# EAGLE design scheda_hat (EAGLE 6.5.0)
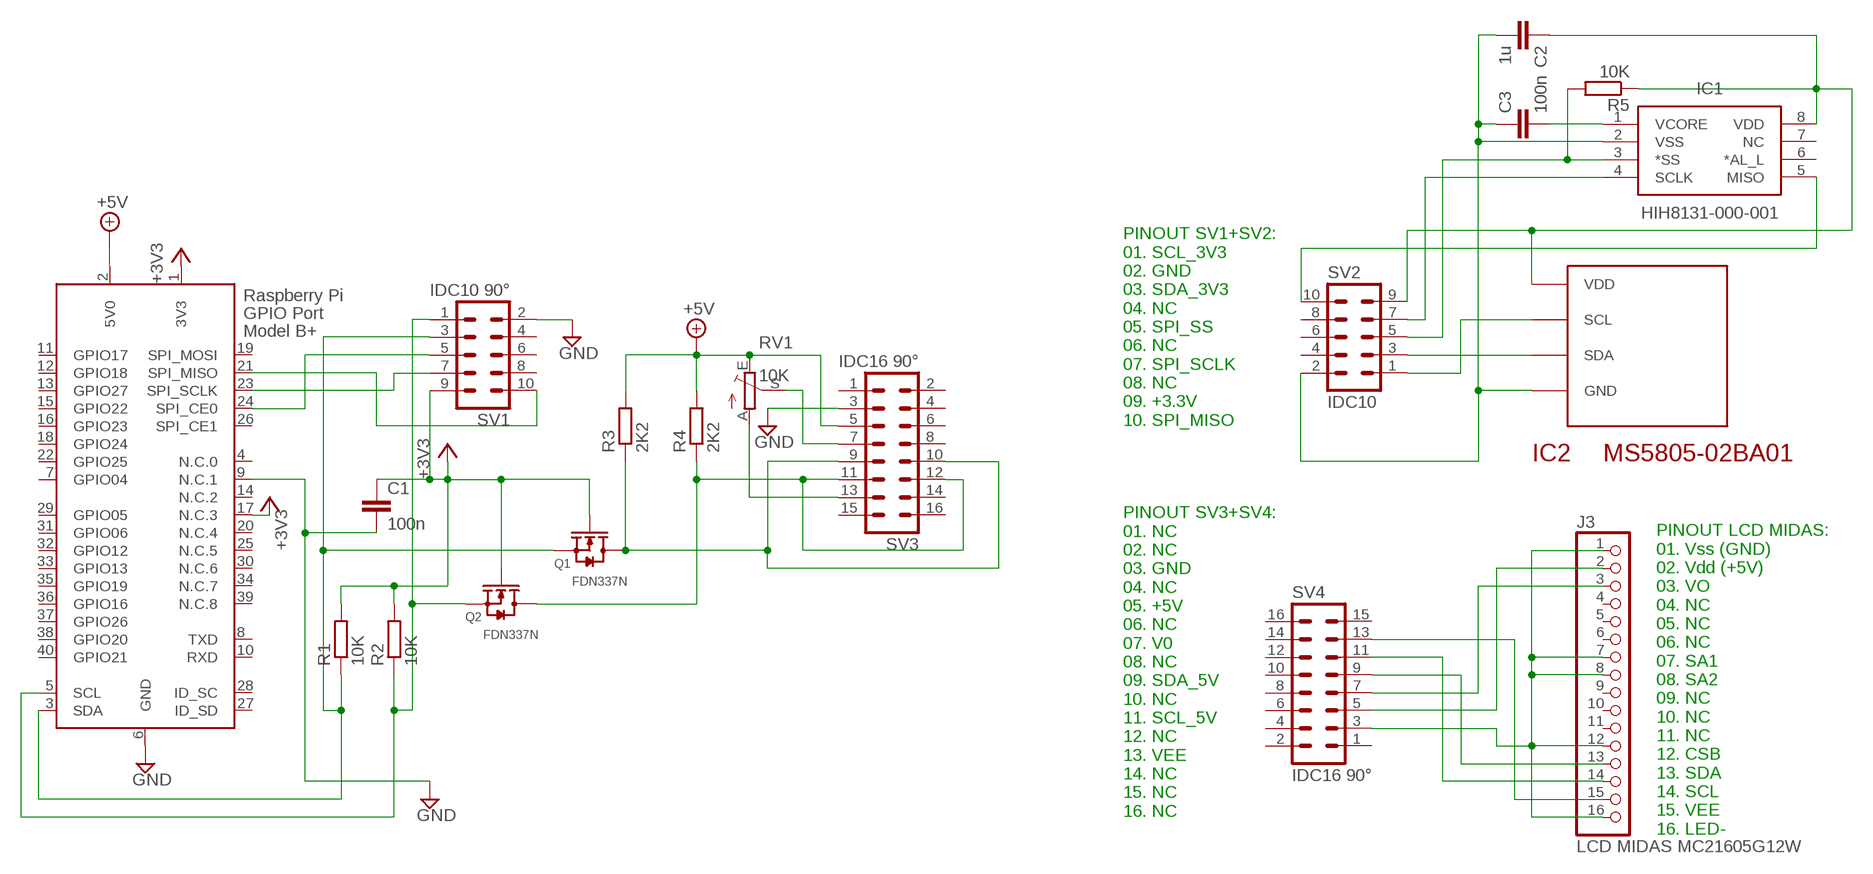
[diagram p0: schematic, sheet 1]

## Parts
C1  100n  C-EUC0805K  [C0805K]
C2  1u  C-EUC0805K  [C0805K]
C3  100n  C-EUC0805K  [C0805K]
IC1  HIH8131-000-001  [SOIC127P600X220-8N]
IC2  MS5805-02BA01  [MS5805-02BA]
J3  LCD MIDAS MC21605G12W  PINHD-1X16  [1X16]
Q1  FDN337N  [SOT95P230X110-3N]
Q2  FDN337N  [SOT95P230X110-3N]
R1  10K  R-EU_R3216  [R3216]
R2  10K  R-EU_R3216  [R3216]
R3  2K2  R-EU_R3216  [R3216]
R4  2K2  R-EU_R3216  [R3216]
R5  10K  R-EU_R3216  [R3216]
RV1  10K  TRIM_EU-CA9V  [CA9V]
SV1  IDC10 90°  ML10L  [ML10L]
SV2  IDC10  ML10  [ML10]
SV3  IDC16 90°  ML16L  [ML16L]
SV4  IDC16 90°  ML16L  [ML16L]
X1  RASPI_BOARD_B+_H  [RASPI_BOARD_B+HAT]

## Nets
+3V3: C1.1 Q1.1(G1) Q2.1(G1) R1.2 R2.2 SV1.9 X1.1(3V3) X1.17(N.C.3)
+5V: R3.2 R4.2 RV1.E SV3.5 X1.2(5V0)
GND: C1.2 SV1.2 SV3.3 X1.6(GND) X1.9(N.C.1)
N$1: IC1.3(*SS) R5.2 SV2.5
N$3: J3.1 J3.7 J3.8 J3.12 J3.16 SV4.3
N$4: RV1.A SV3.13
N$6: J3.15 SV4.13
N$7: C2.2 C3.1 IC1.2(VSS) IC2.P$4(GND) SV2.2
N$8: IC2.P$2(SCL) SV2.1
N$10: IC2.P$3(SDA) SV2.3
N$11: J3.2 SV4.5
N$12: IC1.5(MISO) SV2.10
N$14: IC1.4(SCLK) SV2.7
N$15: J3.3 SV4.7
N$16: J3.13 SV4.9
N$17: J3.14 SV4.11
N$18: C2.1 IC1.8(VDD) IC2.P$1(VDD) R5.1 SV2.9
SCL_3V3: Q2.2(S1) R2.1 SV1.1 X1.5(SCL)
SCL_5V: Q2.3(D1) R4.1 SV3.11 SV3.12
SDA_3V3: Q1.2(S1) R1.1 SV1.3 X1.3(SDA)
SDA_5V: Q1.3(D1) R3.1 SV3.9 SV3.10
SPI_MISO: SV1.10 X1.21(SPI_MISO)
SPI_SCLK: SV1.7 X1.23(SPI_SCLK)
SPI_SS: SV1.5 X1.24(SPI_CE0)
V0: RV1.S SV3.7
VCORE: C3.2 IC1.1(VCORE)
Unconnected: IC1.6(*AL_L) IC1.7(NC) J3.4 J3.5 J3.6 J3.9 J3.10 J3.11 SV1.4 SV1.6 SV1.8 SV2.4 SV2.6 SV2.8 SV3.1 SV3.2 SV3.4 SV3.6 SV3.8 SV3.14 SV3.15 SV3.16 SV4.1 SV4.2 SV4.4 SV4.6 SV4.8 SV4.10 SV4.12 SV4.14 SV4.15 SV4.16 X1.4(N.C.0) X1.7(GPIO04) X1.8(TXD) X1.10(RXD) X1.11(GPIO17) X1.12(GPIO18) X1.13(GPIO27) X1.14(N.C.2) X1.15(GPIO22) X1.16(GPIO23) X1.18(GPIO24) X1.19(SPI_MOSI) X1.20(N.C.4) X1.22(GPIO25) X1.25(N.C.5) X1.26(SPI_CE1) X1.27(ID_SD) X1.28(ID_SC) X1.29(GPIO05) X1.30(N.C.6) X1.31(GPIO06) X1.32(GPIO12) X1.33(GPIO13) X1.34(N.C.7) X1.35(GPIO19) X1.36(GPIO16) X1.37(GPIO26) X1.38(GPIO20) X1.39(N.C.8) X1.40(GPIO21)

## Notes on the sheet
- PINOUT SV1+SV2:
  01. SCL_3V3
  02. GND
  03. SDA_3V3
  04. NC
  05. SPI_SS
  06. NC
  07. SPI_SCLK
  08. NC
  09. +3.3V
  10. SPI_MISO
- PINOUT SV3+SV4:
  01. NC
  02. NC
  03. GND
  04. NC
  05. +5V
  06. NC
  07. V0
  08. NC
  09. SDA_5V
  10. NC
  11. SCL_5V
  12. NC
  13. VEE
  14. NC
  15. NC
  16. NC
- PINOUT LCD MIDAS:
  01. Vss (GND)
  02. Vdd (+5V)
  03. VO
  04. NC
  05. NC
  06. NC
  07. SA1
  08. SA2
  09. NC
  10. NC
  11. NC
  12. CSB
  13. SDA
  14. SCL
  15. VEE
  16. LED-

## Library data of the parts
C1-C3 = resistor:C-EU: CAPACITOR, European symbol
IC1 = tonazza:HIH8131-000-001: Honeywell HIH8131-000-001 Humidity Sensor 8-Pin SOIC, -40 +125 C <http://uk.rs-online.com/largeimages/M1428-01-rs-logo.gif> Source: Datasheet <http://sensing.honeywell.com/honeywell-sensing-humidicon-hih8000-series-product-sheet-009075-7-en.pdf>; DESCRIPTION: Honeywell HIH8131-000-001 Humidity Sensor 8-Pin SOIC, -40 +125 C; HEIGHT: 2.2mm; MANUFACTURER_NAME: Honeywell; MANUFACTURER_PART_NUMBER: HIH8131-000-001; RS_PART_NUMBER: 8748744; SUPPLIER_NAME: RS
IC2 = tonazza:MS5805-02BA01: Absolute Pressure Sensor
J3 = pinhead:PINHD-1X16: PIN HEADER
Q1 Q2 = tonazza:FDN337N: N-channel MOSFET; MPN: FDN337N; OC_FARNELL: 9845356; PACKAGE: SOT-23; SUPPLIER: Fairchild
R1-R5 = resistor:R-EU_: RESISTOR, European symbol
RV1 = pot:TRIM_EU-: POTENTIOMETER
SV1 SV2 = con-harting-ml:ML10: HARTING; OC_FARNELL: unknown; OC_NEWARK: unknown
SV3 SV4 = con-harting-ml:ML16: HARTING; OC_FARNELL: unknown; OC_NEWARK: unknown
X1 = raspberrypi_bastelstube_v13:RASPI_BOARD_B+: Raspberry Pi GPIO connector with markings for the outer dimensions of the Raspberry Pi board model B+ with different sets of drill holes or mounting pads

## Board
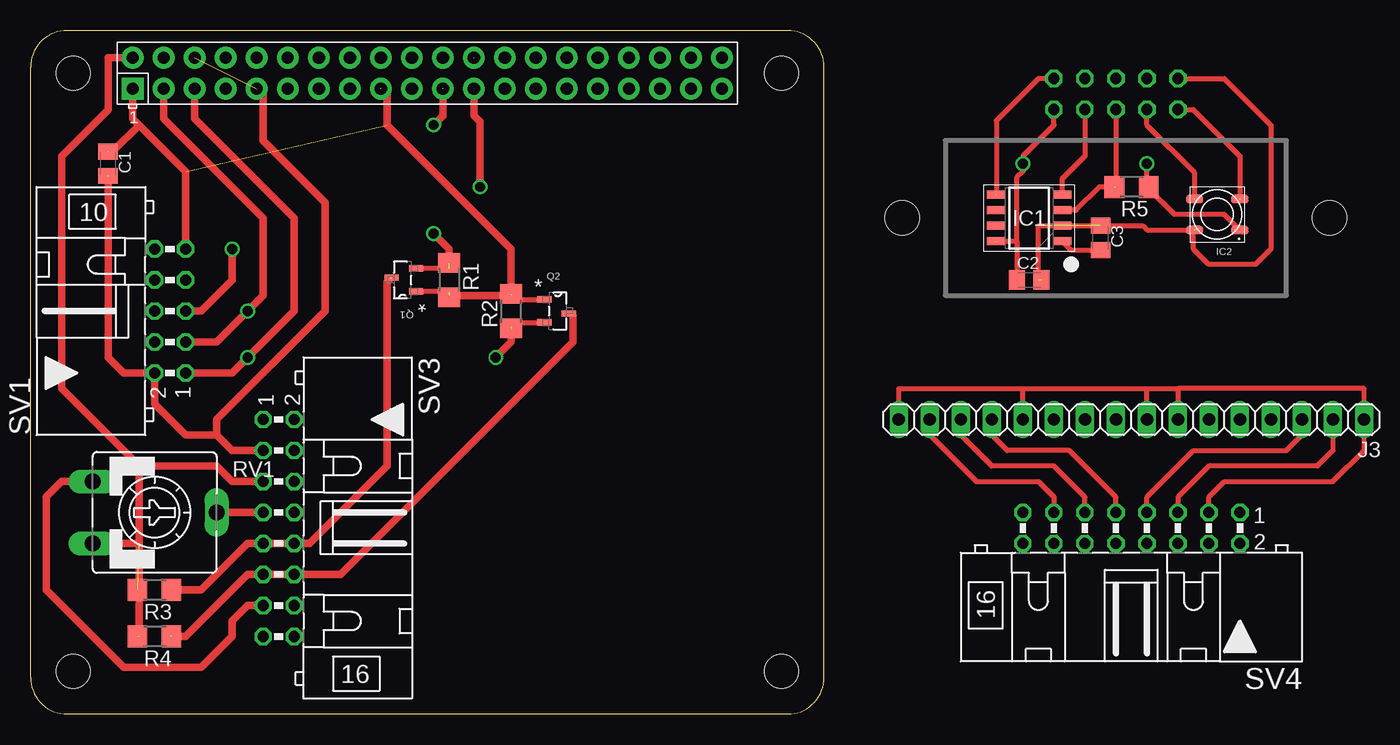
[diagram p1: board, top side]
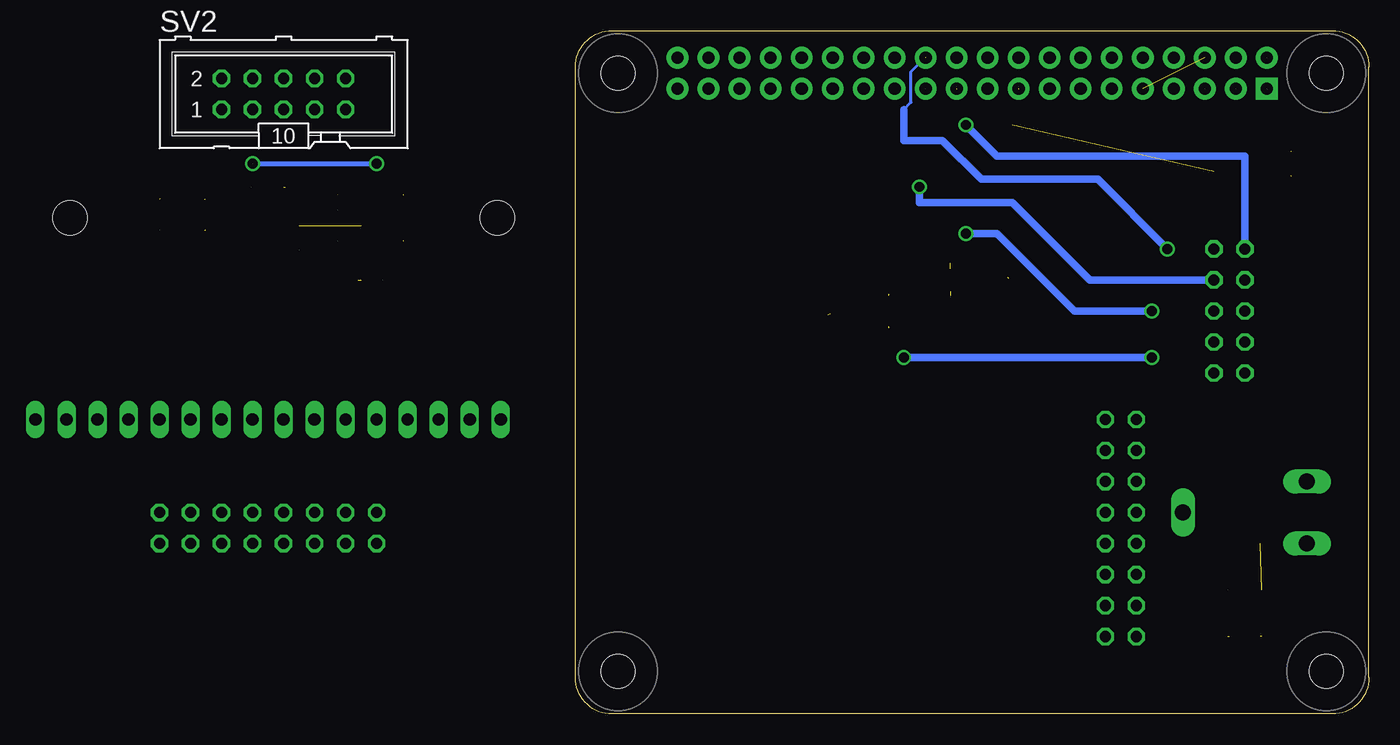
[diagram p2: board, bottom side, seen from below]

Size 65 x 56 mm. Coordinates in mm from the lower left corner, seen from the top.
Copper layers (1*16): Top 0.035mm / dielectric 1.5mm / Bottom 0.035mm
Design rules "tonazza0.5mm *": minimum track width 10mil, minimum drill 24mil, track to track 22mil, track to pad 22mil, pad to pad 22mil, via to via 22mil, smd to smd 8mil, copper to edge 25mil, drill to drill 8mil, minimum pad ring 10mil, minimum via ring 8mil, stop-mask expansion 4mil, vias tented up to drill 0mil, thermal gap 10mil
Holes 2.8 mm at 71.4,40.64 106.4,40.64

### Footprints (pad centres in the part's own frame; a part is rotated, then mirrored left to right if it is on the bottom)
C0805K = smd 1.3 x 1.6: 1 -1,0; 2 1,0
SOIC127P600X220-8N = smd 1.5 x 0.65: 1 -2.7,1.905; 2 -2.7,0.635; 3 -2.7,-0.635; 4 -2.7,-1.905; 5 2.7,-1.905; 6 2.7,-0.635; 7 2.7,0.635; 8 2.7,1.905
MS5805-02BA = smd 1.422 x 0.711: P$1 0.4,3.52; P$2 0.4,0.98; P$3 4.1,0.98; P$4 4.1,3.52
1X16 = drill 1.016 long: 1 -19.05,0; 2 -16.51,0; 3 -13.97,0; 4 -11.43,0; 5 -8.89,0; 6 -6.35,0; 7 -3.81,0; 8 -1.27,0; 9 1.27,0; 10 3.81,0; 11 6.35,0; 12 8.89,0; 13 11.43,0; 14 13.97,0; 15 16.51,0; 16 19.05,0
SOT95P230X110-3N = smd 1.168 x 0.533: 1 -1.092,0.94; 2 -1.092,-0.94 | smd 1.168 x 0.483: 3 0.914,-0.203
R3216 = smd 1.6 x 1.8: 1 -1.4,0; 2 1.4,0
CA9V = drill 1.321 long: A -2.54,-5.08; E 2.54,-5.08; S 0,5.08
ML10L = drill 0.914 octagon: 1 -5.08,-1.27; 2 -5.08,1.27; 3 -2.54,-1.27; 4 -2.54,1.27; 5 0,-1.27; 6 0,1.27; 7 2.54,-1.27; 8 2.54,1.27; 9 5.08,-1.27; 10 5.08,1.27
ML10 = drill 0.914 octagon: 1 -5.08,-1.27; 2 -5.08,1.27; 3 -2.54,-1.27; 4 -2.54,1.27; 5 0,-1.27; 6 0,1.27; 7 2.54,-1.27; 8 2.54,1.27; 9 5.08,-1.27; 10 5.08,1.27
ML16L = drill 0.914 octagon: 1 -8.89,-1.27; 2 -8.89,1.27; 3 -6.35,-1.27; 4 -6.35,1.27; 5 -3.81,-1.27; 6 -3.81,1.27; 7 -1.27,-1.27; 8 -1.27,1.27; 9 1.27,-1.27; 10 1.27,1.27; 11 3.81,-1.27; 12 3.81,1.27; 13 6.35,-1.27; 14 6.35,1.27; 15 8.89,-1.27; 16 8.89,1.27
RASPI_BOARD_B+HAT = drill 1 pad 1.778 square: 1 8.37,51.23 | drill 1 pad 1.778: 2 8.37,53.77; 3 10.91,51.23; 4 10.91,53.77; 5 13.45,51.23; 6 13.45,53.77; 7 15.99,51.23; 8 15.99,53.77; 9 18.53,51.23; 10 18.53,53.77; 11 21.07,51.23; 12 21.07,53.77; 13 23.61,51.23; 14 23.61,53.77; 15 26.15,51.23; 16 26.15,53.77; 17 28.69,51.23; 18 28.69,53.77; 19 31.23,51.23; 20 31.23,53.77; 21 33.77,51.23; 22 33.77,53.77; 23 36.31,51.23; 24 36.31,53.77; 25 38.85,51.23; 26 38.85,53.77; 27 41.39,51.23; 28 41.39,53.77; 29 43.93,51.23; 30 43.93,53.77; 31 46.47,51.23; 32 46.47,53.77; 33 49.01,51.23; 34 49.01,53.77; 35 51.55,51.23; 36 51.55,53.77; 37 54.09,51.23; 38 54.09,53.77; 39 56.63,51.23; 40 56.63,53.77 | hole 2.75: 3.5,3.5; 3.5,52.5; 61.5,3.5; 61.5,52.5

### Placement (x,y rotation side)
C1  6.35,45.09 270 top
C2  81.79,35.56 0 top  (outside the outline)
C3  87.63,39.01 270 top  (outside the outline)
IC1  81.79,40.64 180 top  (outside the outline)
IC2  99.44,43.18 180 top  (outside the outline)
J3  90.17,24.13 180 top  (outside the outline)
Q1  30.48,35.56 180 top
Q2  43.18,33.02 0 top
R1  34.29,35.56 270 top
R2  39.37,33.02 90 top
R3  10.16,10.16 180 top
R4  10.16,6.35 180 top
R5  90.17,43.18 180 top  (outside the outline)
RV1  10.16,16.51 270 top
SV1  11.43,33.02 90 top
SV2  88.9,50.8 0 bottom  (outside the outline)
SV3  20.32,15.24 270 top
SV4  90.17,15.24 180 top  (outside the outline)
X1  0,0 0 top

### Tracks (layer width: path | path; a pad name or v marks a point on that pad's centre or on a via)
+3V3  (7 unrouted)
  Top 0.406: 34.29,34.62 Q1.1 | 39.37,34.29 39.7,33.96 Q2.1
  Top 0.61: SV1.9 12.7,44.45 8.89,48.26 | 8.89,48.26 8.38,48.77 8.38,51.23 | 8.89,48.26 6.73,46.1 C1.1 | R1.2 34.29,34.29 39.37,34.29 39.37,38.1 29.21,48.26 29.21,50.72 28.7,51.23
+5V  (3 unrouted)
  Top 0.61: 8.36,53.77 6.35,53.77 6.35,49.53 2.54,45.72 2.54,26.67 8.89,20.32 | 8.89,20.32 15.24,20.32 16.51,19.05 SV3.5 | RV1.E 8.89,13.97 | 8.89,13.97 8.89,20.32 | 8.89,13.97 8.89,6.35
GND  (3 unrouted)
  Top 0.61: 15.24,22.86 12.7,22.86 10.16,25.4 SV1.2 7.62,27.94 6.35,29.21 C1.2 | 15.24,22.86 16.51,21.59 SV3.3 | 18.54,51.23 19.05,50.72 19.05,46.99 24.13,41.91 24.13,33.02 15.24,24.13 15.24,22.86
N$1  (2 unrouted)
  Top 0.406: SV2.5 88.9,43.18 87.53,43.18 85.62,41.27 IC1.3
N$3
  Top 0.406: SV4.3 96.52,17.78 97.79,19.05 106.68,19.05 109.22,21.59 J3.1 109.22,26.67 93.98,26.67 | 93.98,26.67 J3.7 | J3.8 91.44,26.67 | 91.44,26.67 93.98,26.67 | J3.12 81.28,26.67 | 81.28,26.67 91.44,26.67 | J3.16 71.12,26.67 81.28,26.67
N$4
  Top 0.61: SV3.13 17.78,8.89 16.51,7.62 16.51,6.35 13.97,3.81 7.62,3.81 1.27,10.16 1.27,17.78 2.54,19.05 RV1.A
N$6
  Top 0.406: J3.15 73.66,22.86 77.47,19.05 82.55,19.05 83.82,17.78 SV4.13
N$7  (5 unrouted)
  Top 0.406: SV2.2 97.79,52.07 101.6,48.26 101.6,38.1 100.33,36.83 96.52,36.83 95.25,38.1 95.25,39.57 95.35,39.67 94.94,39.67 | 95.35,39.65 91.44,39.65 91.08,40.01 82.55,40.01 82.55,35.56
N$8  (1 unrouted)
  Top 0.406: SV2.1 95.25,49.53 99.06,45.72 99.06,42.22 IC2.P$2
N$10  (1 unrouted)
  Top 0.406: 95.35,42.19 95.35,44.35 91.44,48.26 SV2.3
N$11
  Top 0.406: J3.2 106.68,21.59 105.41,20.32 96.52,20.32 93.98,17.78 SV4.5
N$12  (1 unrouted)
  Top 0.406: SV2.10 82.55,52.07 79.1,48.62 IC1.5
N$14  (1 unrouted)
  Top 0.406: SV2.7 86.36,45.72 84.48,43.84 IC1.4
N$15
  Top 0.406: SV4.7 91.44,17.78 95.25,21.59 102.87,21.59 104.14,22.86 J3.3
N$16
  Top 0.406: SV4.9 88.9,17.78 85.09,21.59 80.01,21.59 78.74,22.86 J3.13
N$17
  Top 0.406: SV4.11 86.36,17.78 83.82,20.32 78.74,20.32 76.2,22.86 J3.14
N$18  (via drill 0.8)  (5 unrouted)
  Top 0.406: IC2.P$1 97.74,40.95 93.67,40.95 91.57,43.05 R5.1 91.44,43.18 91.44,45.11 | 80.8,38.73 80.8,43.97 81.28,44.45 v81.28,45.09 81.28,45.72 83.82,48.26 SV2.9 | IC1.8 80.8,38.73 | 80.8,38.73 C2.1
  Bottom 0.406: v91.44,45.09 v81.28,45.09
SCL_3V3  (via drill 0.8)  (2 unrouted)
  Top 0.406: 39.37,31.75 39.7,32.08 Q2.2
  Top 0.61: SV1.1 16.51,27.94 v17.78,29.21 21.59,33.02 21.59,40.64 13.46,48.77 13.46,51.23 | v38.1,29.21 39.37,30.48 39.37,31.75
  Bottom 0.61: v17.78,29.21 v38.1,29.21
SCL_5V  (2 unrouted)
  Top 0.61: 11.43,6.35 12.7,6.35 17.78,11.43 SV3.11 SV3.12 25.4,11.43 44.45,30.48 44.45,32.61 44.32,32.74
SDA_3V3  (via drill 0.8)  (3 unrouted)
  Top 0.406: 34.29,36.5 Q1.2
  Top 0.61: SV1.3 15.24,30.48 v17.78,33.02 19.05,34.29 19.05,40.64 10.92,48.77 10.92,51.23 | v33.02,39.37 34.29,38.1 34.29,36.83
  Bottom 0.61: v17.78,33.02 24.13,33.02 30.48,39.37 v33.02,39.37
SDA_5V  (2 unrouted)
  Top 0.61: R3.1 13.97,10.16 17.78,13.97 SV3.9 SV3.10 22.86,13.97 29.21,20.32 29.21,35.41 29.49,35.69
SPI_MISO  (via drill 0.8)  (1 unrouted)
  Top 0.61: v33.02,48.26 33.78,49.02 33.78,51.23
  Bottom 0.61: v33.02,48.26 30.48,45.72 10.16,45.72 SV1.10
SPI_SCLK  (via drill 0.8)  (1 unrouted)
  Top 0.61: v36.83,43.18 36.83,48.51 36.32,49.02 36.32,51.23
  Bottom 0.61: SV1.7 22.86,35.56 29.21,41.91 36.83,41.91 v36.83,43.18
SPI_SS  (via drill 0.8)  (1 unrouted)
  Top 0.61: v16.51,38.1 16.51,35.56 13.97,33.02 SV1.5
  Bottom 0.254: 38.1,49.53 37.52,50.11 37.52,52.63 36.37,53.77 36.3,53.77
  Bottom 0.61: v16.51,38.1 22.23,43.81 31.75,43.81 34.92,46.99 38.1,46.99 38.1,49.53
V0
  Top 0.61: SV3.7 RV1.S
VCORE  (2 unrouted)
  Top 0.406: IC1.1 85.19,38.02 87.63,38.02